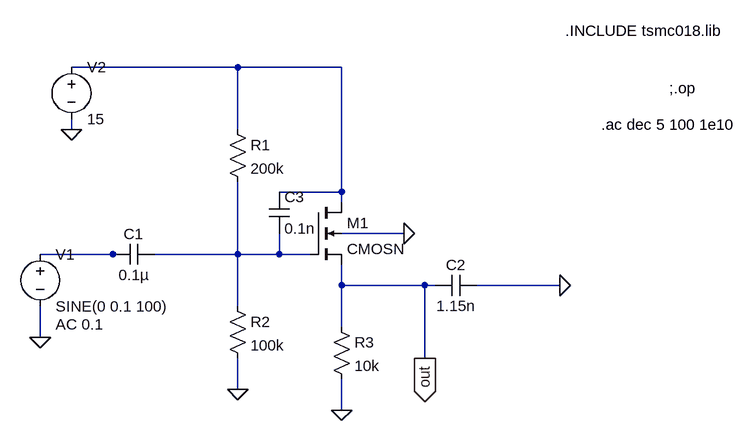
[diagram p0: schematic common drain.asc]
common drain.asc, the LTspice schematic file:
Version 4
SHEET 1 884 680
WIRE 96 -96 -160 -96
WIRE 256 -96 96 -96
WIRE -160 0 -160 -16
WIRE 96 0 96 -96
WIRE 256 96 256 -96
WIRE 256 96 160 96
WIRE 256 112 256 96
WIRE 352 160 256 160
WIRE -96 192 -208 192
WIRE -80 192 -96 192
WIRE 96 192 96 80
WIRE 96 192 -32 192
WIRE 160 192 160 160
WIRE 160 192 96 192
WIRE 208 192 160 192
WIRE 256 240 256 208
WIRE 384 240 256 240
WIRE 400 240 384 240
WIRE 592 240 464 240
WIRE 96 272 96 192
WIRE 256 304 256 240
WIRE -208 320 -208 272
WIRE 384 352 384 240
WIRE 96 400 96 352
WIRE 256 432 256 384
FLAG 256 432 0
FLAG -208 320 0
FLAG -160 0 0
FLAG 352 160 0
FLAG 592 240 0
FLAG 384 352 out
IOPIN 384 352 Out
FLAG 96 400 0
SYMBOL nmos4 208 112 R0
SYMATTR InstName M1
SYMATTR Value CMOSN
SYMATTR Value2 l=510n w=550u
SYMBOL cap -32 176 R90
WINDOW 0 0 32 VBottom 2
WINDOW 3 32 32 VTop 2
SYMATTR InstName C1
SYMATTR Value 0.1µ
SYMBOL res 240 288 R0
SYMATTR InstName R3
SYMATTR Value 10k
SYMBOL cap 464 224 R90
WINDOW 0 0 32 VBottom 2
WINDOW 3 32 32 VTop 2
SYMATTR InstName C2
SYMATTR Value 1.15n
SYMBOL voltage -208 176 R0
WINDOW 123 24 124 Left 2
WINDOW 39 0 0 Left 0
SYMATTR InstName V1
SYMATTR Value SINE(0 0.1 100)
SYMATTR Value2 AC 0.1
SYMBOL voltage -160 -112 R0
WINDOW 123 0 0 Left 0
WINDOW 39 0 0 Left 0
SYMATTR InstName V2
SYMATTR Value 15
SYMBOL res 80 -16 R0
SYMATTR InstName R1
SYMATTR Value 200k
SYMBOL res 80 256 R0
SYMATTR InstName R2
SYMATTR Value 100k
SYMBOL cap 144 96 R0
SYMATTR InstName C3
SYMATTR Value 0.1n
TEXT 760 -64 Left 2 !;.op
TEXT 600 -152 Left 2 !.INCLUDE tsmc018.lib
TEXT 656 -8 Left 2 !.ac dec 5 100 1e10

The netlist it stands for:
* common drain.asc
M1 N001 N003 out 0 CMOSN l=510n w=550u
C1 N003 N002 0.1µ
R3 out 0 10k
C2 0 out 1.15n
V1 N002 0 SINE(0 0.1 100) AC 0.1
V2 N001 0 15
R1 N001 N003 200k
R2 N003 0 100k
C3 N001 N003 0.1n
.model NMOS NMOS
.model PMOS PMOS
.lib standard.mos
;.op
.INCLUDE tsmc018.lib
.ac dec 5 100 1e10
.backanno
.end